# Altium project compute_fpga.PrjPcb (part 2 of 2)

## Sheet compute module USB.SchDoc: Compute Module USB
size A4; Organization: Blinkinlabs, LLC; DocumentNumber: 7; SheetNumber: 7; SheetTotal: 14
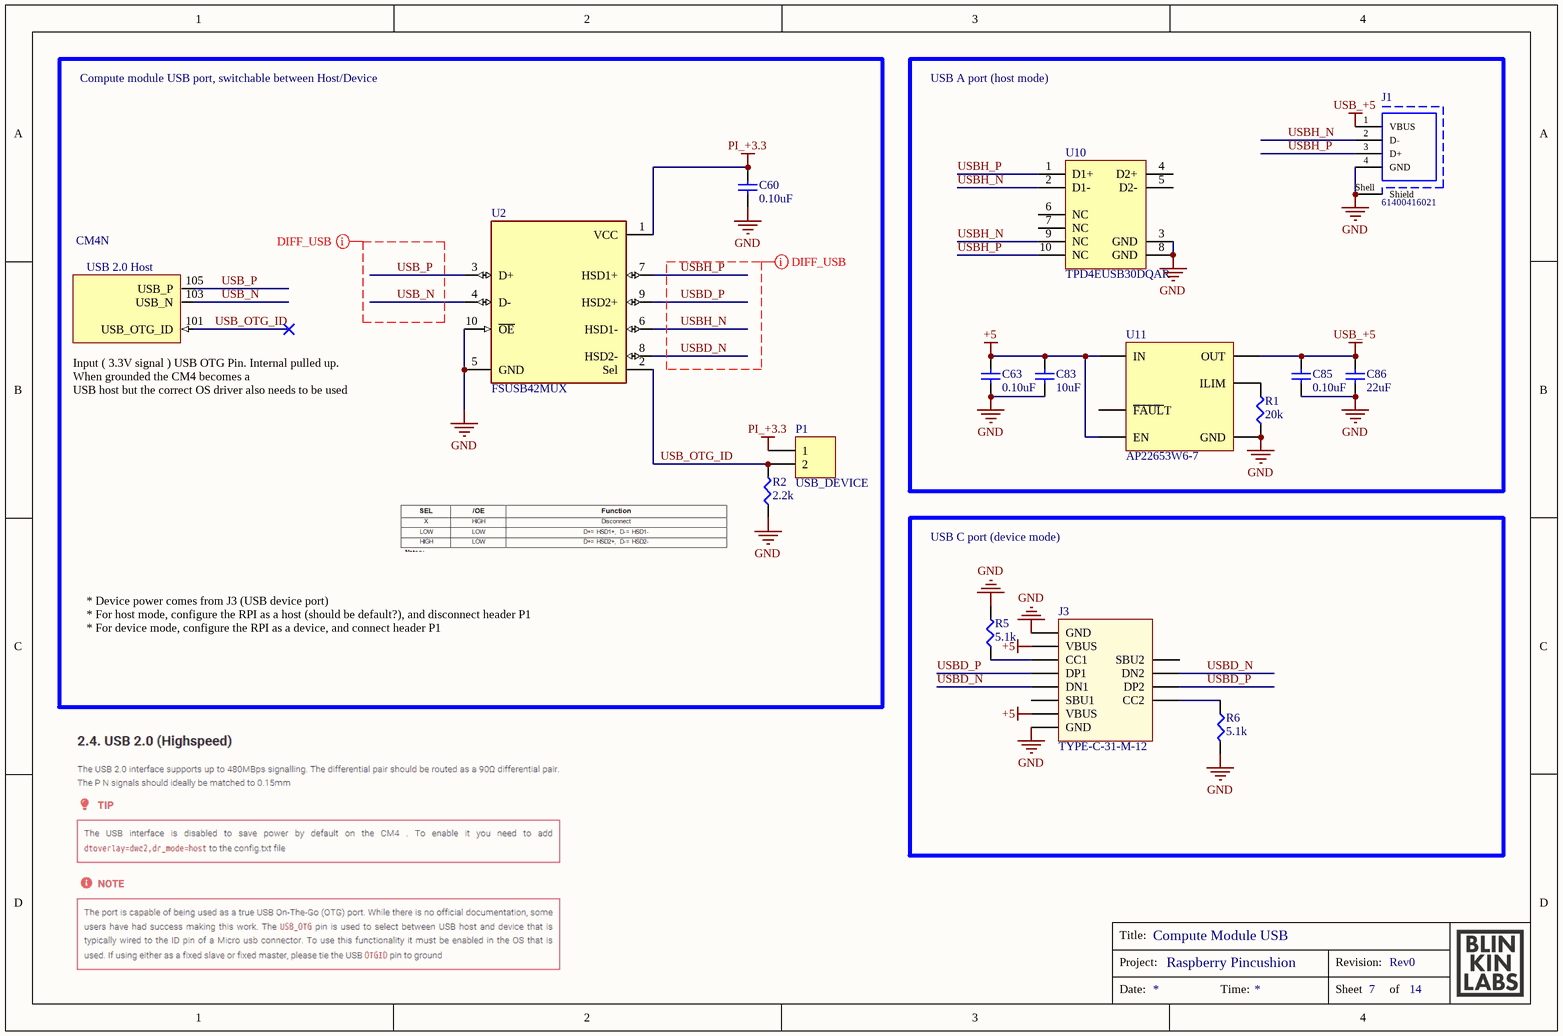
[diagram p10: compute module USB.SchDoc]

### Parts
C60  0.10uF  [CAPC1005X06L]
C63  0.10uF  [CAPC1005X06L]
C83  10uF  [CAPC2012X10L]
C85  0.10uF  [CAPC1005X06L]
C86  22uF  [CAPC2012X10L]
CM4  Raspberry Pi Compute Module 4  [CM4-F40C-100DS-0.4v_1.5mm_0mm]  (value not drawn)  (part N of 21)
J1  61400416021  [61400416021]
J3  TYPE-C-31-M-12  [TYPE-C-31-M-12]
P1  USB_DEVICE  [HDR1X2]
R1  20k  [ERJ2G(0402)_L]
R2  2.2k  [ERJ2G(0402)_L]
R5  5.1k  [ERJ2G(0402)_N]
R6  5.1k  [ERJ2G(0402)_N]
U2  FSUSB42MUX  [FP-846AP-MFG]
U10  TPD4EUSB30DQAR  [DQA0010A_V]
U11  AP22653W6-7  [SOT95P280X145-6N-5]

### Blocks framed on the sheet
Compute module USB port, switchable between Host/Device: C60 CM4 P1 R2 U2
USB A port (host mode): C63 C83 C85 C86 J1 R1 U10 U11
USB C port (device mode): J3 R5 R6

### Nets
+5: C63.2 C83.1 J3.A4/B9(VBUS) J3.A9/B4(VBUS) U11.1(IN) U11.3(EN)
GND: C60.1 C63.1 C83.2 C85.1 C86.2 J1.4(GND) J1.Shell(Shield) J3.A1/B12(GND) J3.A12/B1(GND) R1.1 R2.1 R5.2 R6.2 U2.5(GND) U2.10(~{OE}) U10.3(GND) U10.8(GND) U11.2(GND)
PI_+3.3: C60.2 P1.1 U2.1(VCC)
USB_+5: C85.2 C86.1 J1.1(VBUS) U11.6(OUT)
USB_N: CM4.103(USB_N) U2.4(D-)
USB_OTG_ID: CM4.101(USB_OTG_ID) P1.2 R2.2 U2.2(Sel)
USB_P: CM4.105(USB_P) U2.3(D+)
USBD_N: J3.A7(DN1) J3.B7(DN2) U2.8(HSD2-)
USBD_P: J3.A6(DP1) J3.B6(DP2) U2.9(HSD2+)
USBH_N: J1.2(D-) U2.6(HSD1-) U10.2(D1-) U10.9(NC)
USBH_P: J1.3(D+) U2.7(HSD1+) U10.1(D1+) U10.10(NC)
NetJ3_A5: J3.A5(CC1) R5.1
NetJ3_B5: J3.B5(CC2) R6.1
NetR1_2: R1.2 U11.5(ILIM)

Not connected (* = marked no-connect by the designer): J3 A8(SBU1) B8(SBU2); U10 4(D2+) 5(D2-) 6(NC) 7(NC); U11 4(~{FAUL}T)

### Layout directives
differential pair; differential pair class DIFF_90Ohm_USB; differential pair class DIFF_USB_HS; net class USB_480MBps; rule Matched Net Lengths [Tolerance = 0.15mm]: USB_N, USB_P, USBD_N, USBD_P, USBH_N, USBH_P

### Notes on the sheet
- * Device power comes from J3 (USB device port)
  * For host mode, configure the RPI as a host (should be default?), and disconnect header P1
  * For device mode, configure the RPI as a device, and connect header P1
- Title:
- Project:
- Revision:
- Date:
- Time:
- Sheet
- of
- (in symbol CM4, part N) USB 2.0 Host; Input ( 3.3V signal ) USB OTG Pin. Internal pulled up. When grounded the CM4 becomes a / USB host but the correct OS driver also needs to be used

### Library data of the parts
C60 C63 C85 = GRM155R61A104KA01D: CAP CER 0.1UF 10V X5R 0402; Manufacturer: Murata Electronics North America; Tolerance: ±10%; PartNumber: GRM155R61A104KA01D; Datasheets: http://www.murata.com/~/media/webrenewal/support/library/catalog/products/capacitor/mlcc/c02e.pdf; Image: //media.digikey.com/Renders/Murata%20Renders/ZRB-SERIES-0402.jpg; Digi-Key Part Number: 490-1318-1-ND; Packaging: Cut Tape (CT); Series: GRM; Value: 0.10uF; Voltage: 10V; Temperature Coefficient: X5R; Operating Temperature: -55°C ~ 85°C; Features: -; Applications: General Purpose; Package / Case: 0402 (1005 Metric); Case/Package: 0402
C83 = GRM21BR71A106KE51L: CAP CER 10UF 10V X7R 0805; Manufacturer: Murata Electronics North America; Tolerance: ±10%; PartNumber: GRM21BR71A106KE51L; Datasheets: http://www.murata.com/~/media/webrenewal/support/library/catalog/products/capacitor/mlcc/c02e.pdf; Image: //media.digikey.com/Renders/Murata%20Renders/0805%20(2012%20Metric)%20.85mm.jpg; Digi-Key Part Number: 490-3905-1-ND; Series: GRM; Part Status: Active; Value: 10uF; Voltage: 10V; Temperature Coefficient: X7R; Operating Temperature: -55°C ~ 125°C; Features: -; Applications: General Purpose; Mounting Type: Surface Mount, MLCC; Package / Case: 0805 (2012 Metric); Case/Package: 0805
C86 = GRM219R61A226MEA0D: CAP CER 22UF 10V X5R 0805; Manufacturer: Murata Electronics North America; Tolerance: ±20%; PartNumber: GRM219R61A226MEA0D; Datasheets: http://www.murata.com/~/media/webrenewal/support/library/catalog/products/capacitor/mlcc/c02e.pdf; Image: //media.digikey.com/Renders/Murata%20Renders/0805%20(2012%20Metric)%20.85mm.jpg; Digi-Key Part Number: 490-9951-1-ND; Series: GRM; Part Status: Active; Value: 22uF; Voltage: 10V; Temperature Coefficient: X5R; Operating Temperature: -55°C ~ 85°C; Features: Derating Recommended; Applications: General Purpose; Mounting Type: Surface Mount, MLCC; Package / Case: 0805 (2012 Metric); Case/Package: 0805
CM4 = CM4: Raspberry Pi Compute Module 4 by Amornthep Phunsin
J1 = CMP-1502-03227-1: USB 2.0 Type A Receptacle WR-COM, Horizontal, THT; Manufacturer: Wurth Elektronik; Working Voltage: 30VAC; Rated Current: 1.5A; Contact Resistance: 20mOhm; Manufacturer URL: http://www.we-online.de; Publisher: WurthElektronik; Packaging: Tray; Operating Temperature: -40to105degC; Orientation: Horizontal; Mounting Technology: THT; Part Number: 61400416021; Gender: Receptacle; Package Reference: 61400416021; Connector Type: USB2.0TypeA; Datasheet URL: https://katalog.we-online.de/em/datasheet/61400416021.pdf
J3 = TYPE-C-31-M-12: USB Connector TYPE-C-31-M-12 Female 16P SMD; Manufacturer: HRO; PartNumber: TYPE-C-31-M-12
P1 = Header 2: Header, 2-Pin; LatestRevisionDate: 17-Jul-2002; LatestRevisionNote: Re-released for DXP Platform.; Publisher: Altium Limited
R1 = ERJ-2RKF2002X: RES SMD 20K OHM 1% 1/10W 0402; Manufacturer: Panasonic Electronic Components; Power (Watts): 0.1W, 1/10W; Temperature Coefficient: ±100ppm/°C; PartNumber: ERJ-2RKF2002X; Datasheets: http://industrial.panasonic.com/www-cgi/jvcr13pz.cgi?E+PZ+3+AOA0002+ERJ2RKF2002X+7+WW; Image: //media.digikey.com/Photos/Panasonic%20Photos/ERJ-PA2-Series.jpg; Digi-Key Part Number: P20.0KLCT-ND; Series: ERJ; Value: 20k; Tolerance: ±1%; Composition: Thick Film; Features: Automotive AEC-Q200; Operating Temperature: -55°C ~ 155°C; Package / Case: 0402 (1005 Metric); Case/Package: 0402; Size / Dimension: 0.039" L x 0.020" W (1.00mm x 0.50mm); Height - Seated (Max): 0.016" (0.40mm); Number of Terminations: 2
R2 = ERJ-2RKF2201X: RES SMD 2.2K OHM 1% 1/10W 0402; Manufacturer: Panasonic Electronic Components; Power (Watts): 0.1W, 1/10W; Temperature Coefficient: ±100ppm/°C; PartNumber: ERJ-2RKF2201X; Datasheets: http://industrial.panasonic.com/www-cgi/jvcr13pz.cgi?E+PZ+3+AOA0002+ERJ2RKF2201X+7+WW; Image: //media.digikey.com/Photos/Panasonic%20Photos/ERJ-PA2-Series.jpg; Digi-Key Part Number: P2.20KLCT-ND; Series: ERJ; Value: 2.2k; Tolerance: ±1%; Composition: Thick Film; Features: Automotive AEC-Q200; Operating Temperature: -55°C ~ 155°C; Package / Case: 0402 (1005 Metric); Case/Package: 0402; Size / Dimension: 0.039" L x 0.020" W (1.00mm x 0.50mm); Height - Seated (Max): 0.016" (0.40mm); Number of Terminations: 2
R5 R6 = ERJ-2RKF5101X: RES SMD 5.1K OHM 1% 1/10W 0402; Manufacturer: Panasonic Electronic Components; Power (Watts): 0.1W, 1/10W; Temperature Coefficient: ±100ppm/°C; PartNumber: ERJ-2RKF5101X; Datasheets: http://industrial.panasonic.com/www-cgi/jvcr13pz.cgi?E+PZ+3+AOA0002+ERJ2RKF5101X+7+WW; Image: //media.digikey.com/Photos/Panasonic%20Photos/ERJ-PA2-Series.jpg; Digi-Key Part Number: P5.10KLCT-ND; Series: ERJ; Value: 5.1k; Tolerance: ±1%; Composition: Thick Film; Features: Automotive AEC-Q200; Operating Temperature: -55°C ~ 155°C; Package / Case: 0402 (1005 Metric); Case/Package: 0402; Size / Dimension: 0.039" L x 0.020" W (1.00mm x 0.50mm); Height - Seated (Max): 0.016" (0.40mm); Number of Terminations: 2
U2 = CMP-07103-000004-1: IC USB SWITCH DPDT 10MSOP; Voltage: 4.3V; Current: 100mA; Number of Inputs: 2; Supply Type: Single; Number of Outputs: 4; Data Rate: 480Mbps; On-State Resistance: 6.5R; Min Supply Voltage: 3V; Package Quantity: 1; Length: 3mm; Radiation Hardening: No; Number of Pins: 10; Width: 3mm; Number of Channels: 2; REACH SVHC: No SVHC; Lead Free: Lead Free; Max Operating Temperature: 85°C; Min Operating Temperature: -40°C; Packaging: Tape and Reel; Throw Configuration: DPDT; Operating Supply Voltage: 4.3V; Max Supply Voltage: 4.3V; Mount: Surface Mount; Case/Package: MSOP; Weight: 0.1125g; Height: 0.85mm
U10 = CMP-0326-00027-3: ESD Solution for Super-Speed (6 GBPS) USB 3.0 Interface, 4 Channels, -40 to +85 degC, 10-pin SON (DQA), Green (RoHS & no Sb/Br); Manufacturer: Texas Instruments; Differential Capacitance(pF): 0.05; Serial ATA / eSATA: TRUE; IO Capacitance(Typ)(pF): 0.8; IO Leakage Current(nA): 10; IEC 61000-4-2 Air-Gap(+/- kV): 8; ComponentLink3Description: URL Link1; PartNumber: TPD4EUSB30DQAR; DatasheetVersion: SLVSAC2C; ComponentLink2URL: http://www.ti.com/general/docs/lit/getliterature.tsp?genericPartNumber=TPD4EUSB30&fileType=pdf; USB Super Speed: TRUE; Eco-Plan: Green (RoHS & no Sb/Br); Mounting Technology: Surface Mount; 1394 / Firewire: TRUE; PackageVersion: revB, Sep-2009; SubFamily: ESD Solution; USB Full Speed: TRUE; USB High Speed: TRUE; ComponentLink2Description: Datasheet; ComponentLink1URL: http://www.ti.com/; IEC 61000-4-2 Contact(+/- kV): 8; Breakdown Voltage(Min)(V): 8; PackageReference: DQA0010A; ComponentLink1Description: Manufacturer URL; PackageDescription: 10-Pin Plastic Small Outline No-Lead, 1 x 2.5 x 0.55 mm Body, 0.5 mm Pitch; ComponentLink3URL: SamplesURL:http://www.ti.com/product/tpd4eusb30#samples; HDMI: TRUE
U11 = AP22653W6-7: LOAD SWITCH,SOT26,T&R,3K; Manufacturer: Diodes Incorporated; PartNumber: AP22653W6-7; Digikey PartNumber: 31-AP22653W6-7TR-ND

## Sheet FPGA GPIO.SchDoc: FPGA GPIO
size A3; Organization: Blinkinlabs, LLC; DocumentNumber: 14; SheetNumber: 10; SheetTotal: 14
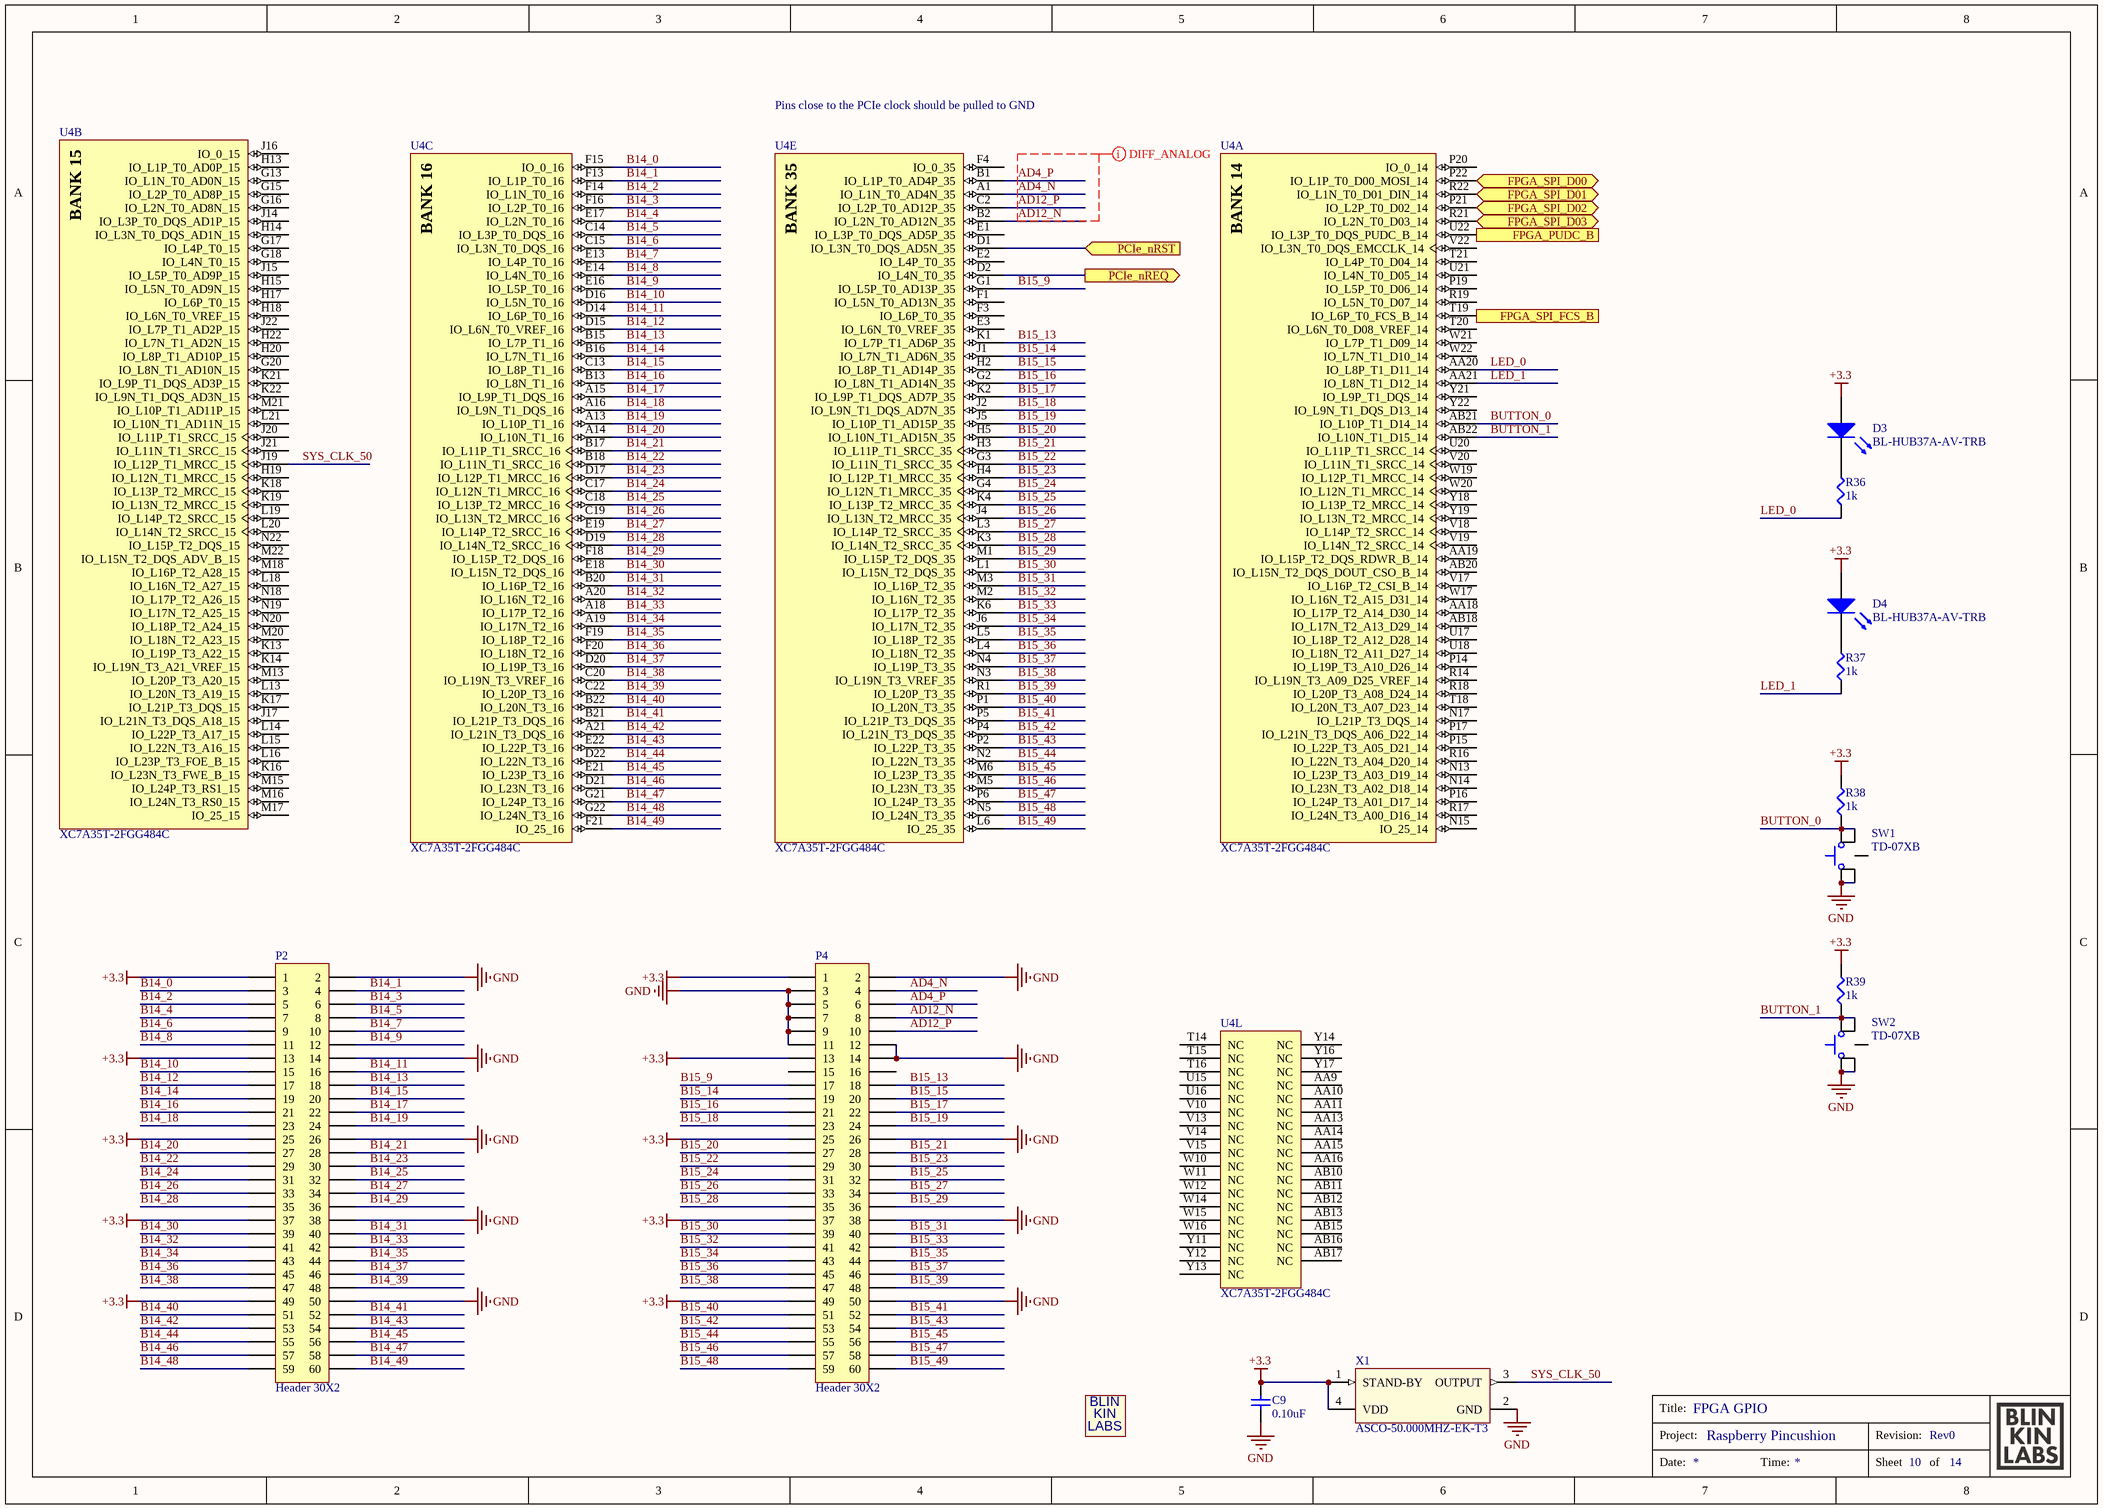
[diagram p11: FPGA GPIO.SchDoc]

### Parts
C9  0.10uF  [CAPC1005X06L]
D3  BL-HUB37A-AV-TRB  [BL-Hxx37A-AV-TRB]
D4  BL-HUB37A-AV-TRB  [BL-Hxx37A-AV-TRB]
L1  BLINKINLABS_LOGO  [BLINKINLABS_LOGO]  (value not drawn)  (no BOM)
P2  Header 30X2  [HDR2X30]
P4  Header 30X2  [HDR2X30]
R36  1k  [ERJ2G(0402)_L]
R37  1k  [ERJ2G(0402)_L]
R38  1k  [ERJ2G(0402)_L]
R39  1k  [ERJ2G(0402)_L]
SW1  TD-07XB  [TD-07XB]
SW2  TD-07XB  [TD-07XB]
U4  XC7A35T-2FGG484C  [FGG484]  (parts A,B,C,E,L of 12)
X1  ASCO-50.000MHZ-EK-T3  [ABRA-ASCO-50.000MHZ-EK-T3-4_V]

### Ports
FPGA_PUDC_B (in), FPGA_SPI_D00 (bidir), FPGA_SPI_D01 (bidir), FPGA_SPI_D02 (bidir), FPGA_SPI_D03 (bidir), FPGA_SPI_FCS_B (out), PCIe_nREQ (out), PCIe_nRST (in)

### Nets
+3.3: C9.2 D3.1 D4.1 P2.1 P2.13 P2.25 P2.37 P2.49 P4.1 P4.13 P4.25 P4.37 P4.49 R38.2 R39.2 X1.1(STAND-BY) X1.4(VDD)
GND: C9.1 P2.2 P2.14 P2.26 P2.38 P2.50 P4.2 P4.3 P4.5 P4.7 P4.9 P4.11 P4.12 P4.14 P4.26 P4.38 P4.50 SW1.1 SW1.2 SW2.1 SW2.2 X1.2(GND)
AD4_N: P4.4 U4.A1(IO_L1N_T0_AD4N_35)
AD4_P: P4.6 U4.B1(IO_L1P_T0_AD4P_35)
AD12_N: P4.8 U4.B2(IO_L2N_T0_AD12N_35)
AD12_P: P4.10 U4.C2(IO_L2P_T0_AD12P_35)
B14_0: P2.3 U4.F15(IO_0_16)
B14_1: P2.4 U4.F13(IO_L1P_T0_16)
B14_2: P2.5 U4.F14(IO_L1N_T0_16)
B14_3: P2.6 U4.F16(IO_L2P_T0_16)
B14_4: P2.7 U4.E17(IO_L2N_T0_16)
B14_5: P2.8 U4.C14(IO_L3P_T0_DQS_16)
B14_6: P2.9 U4.C15(IO_L3N_T0_DQS_16)
B14_7: P2.10 U4.E13(IO_L4P_T0_16)
B14_8: P2.11 U4.E14(IO_L4N_T0_16)
B14_9: P2.12 U4.E16(IO_L5P_T0_16)
B14_10: P2.15 U4.D16(IO_L5N_T0_16)
B14_11: P2.16 U4.D14(IO_L6P_T0_16)
B14_12: P2.17 U4.D15(IO_L6N_T0_VREF_16)
B14_13: P2.18 U4.B15(IO_L7P_T1_16)
B14_14: P2.19 U4.B16(IO_L7N_T1_16)
B14_15: P2.20 U4.C13(IO_L8P_T1_16)
B14_16: P2.21 U4.B13(IO_L8N_T1_16)
B14_17: P2.22 U4.A15(IO_L9P_T1_DQS_16)
B14_18: P2.23 U4.A16(IO_L9N_T1_DQS_16)
B14_19: P2.24 U4.A13(IO_L10P_T1_16)
B14_20: P2.27 U4.A14(IO_L10N_T1_16)
B14_21: P2.28 U4.B17(IO_L11P_T1_SRCC_16)
B14_22: P2.29 U4.B18(IO_L11N_T1_SRCC_16)
B14_23: P2.30 U4.D17(IO_L12P_T1_MRCC_16)
B14_24: P2.31 U4.C17(IO_L12N_T1_MRCC_16)
B14_25: P2.32 U4.C18(IO_L13P_T2_MRCC_16)
B14_26: P2.33 U4.C19(IO_L13N_T2_MRCC_16)
B14_27: P2.34 U4.E19(IO_L14P_T2_SRCC_16)
B14_28: P2.35 U4.D19(IO_L14N_T2_SRCC_16)
B14_29: P2.36 U4.F18(IO_L15P_T2_DQS_16)
B14_30: P2.39 U4.E18(IO_L15N_T2_DQS_16)
B14_31: P2.40 U4.B20(IO_L16P_T2_16)
B14_32: P2.41 U4.A20(IO_L16N_T2_16)
B14_33: P2.42 U4.A18(IO_L17P_T2_16)
B14_34: P2.43 U4.A19(IO_L17N_T2_16)
B14_35: P2.44 U4.F19(IO_L18P_T2_16)
B14_36: P2.45 U4.F20(IO_L18N_T2_16)
B14_37: P2.46 U4.D20(IO_L19P_T3_16)
B14_38: P2.47 U4.C20(IO_L19N_T3_VREF_16)
B14_39: P2.48 U4.C22(IO_L20P_T3_16)
B14_40: P2.51 U4.B22(IO_L20N_T3_16)
B14_41: P2.52 U4.B21(IO_L21P_T3_DQS_16)
B14_42: P2.53 U4.A21(IO_L21N_T3_DQS_16)
B14_43: P2.54 U4.E22(IO_L22P_T3_16)
B14_44: P2.55 U4.D22(IO_L22N_T3_16)
B14_45: P2.56 U4.E21(IO_L23P_T3_16)
B14_46: P2.57 U4.D21(IO_L23N_T3_16)
B14_47: P2.58 U4.G21(IO_L24P_T3_16)
B14_48: P2.59 U4.G22(IO_L24N_T3_16)
B14_49: P2.60 U4.F21(IO_25_16)
B15_9: P4.17 U4.G1(IO_L5P_T0_AD13P_35)
B15_13: P4.18 U4.K1(IO_L7P_T1_AD6P_35)
B15_14: P4.19 U4.J1(IO_L7N_T1_AD6N_35)
B15_15: P4.20 U4.H2(IO_L8P_T1_AD14P_35)
B15_16: P4.21 U4.G2(IO_L8N_T1_AD14N_35)
B15_17: P4.22 U4.K2(IO_L9P_T1_DQS_AD7P_35)
B15_18: P4.23 U4.J2(IO_L9N_T1_DQS_AD7N_35)
B15_19: P4.24 U4.J5(IO_L10P_T1_AD15P_35)
B15_20: P4.27 U4.H5(IO_L10N_T1_AD15N_35)
B15_21: P4.28 U4.H3(IO_L11P_T1_SRCC_35)
B15_22: P4.29 U4.G3(IO_L11N_T1_SRCC_35)
B15_23: P4.30 U4.H4(IO_L12P_T1_MRCC_35)
B15_24: P4.31 U4.G4(IO_L12N_T1_MRCC_35)
B15_25: P4.32 U4.K4(IO_L13P_T2_MRCC_35)
B15_26: P4.33 U4.J4(IO_L13N_T2_MRCC_35)
B15_27: P4.34 U4.L3(IO_L14P_T2_SRCC_35)
B15_28: P4.35 U4.K3(IO_L14N_T2_SRCC_35)
B15_29: P4.36 U4.M1(IO_L15P_T2_DQS_35)
B15_30: P4.39 U4.L1(IO_L15N_T2_DQS_35)
B15_31: P4.40 U4.M3(IO_L16P_T2_35)
B15_32: P4.41 U4.M2(IO_L16N_T2_35)
B15_33: P4.42 U4.K6(IO_L17P_T2_35)
B15_34: P4.43 U4.J6(IO_L17N_T2_35)
B15_35: P4.44 U4.L5(IO_L18P_T2_35)
B15_36: P4.45 U4.L4(IO_L18N_T2_35)
B15_37: P4.46 U4.N4(IO_L19P_T3_35)
B15_38: P4.47 U4.N3(IO_L19N_T3_VREF_35)
B15_39: P4.48 U4.R1(IO_L20P_T3_35)
B15_40: P4.51 U4.P1(IO_L20N_T3_35)
B15_41: P4.52 U4.P5(IO_L21P_T3_DQS_35)
B15_42: P4.53 U4.P4(IO_L21N_T3_DQS_35)
B15_43: P4.54 U4.P2(IO_L22P_T3_35)
B15_44: P4.55 U4.N2(IO_L22N_T3_35)
B15_45: P4.56 U4.M6(IO_L23P_T3_35)
B15_46: P4.57 U4.M5(IO_L23N_T3_35)
B15_47: P4.58 U4.P6(IO_L24P_T3_35)
B15_48: P4.59 U4.N5(IO_L24N_T3_35)
B15_49: P4.60 U4.L6(IO_25_35)
BUTTON_0: R38.1 SW1.3 SW1.4 U4.AB21(IO_L10P_T1_D14_14)
BUTTON_1: R39.1 SW2.3 SW2.4 U4.AB22(IO_L10N_T1_D15_14)
FPGA_PUDC_B: U4.U22(IO_L3P_T0_DQS_PUDC_B_14) ; port FPGA_PUDC_B
FPGA_SPI_D02: U4.P21(IO_L2P_T0_D02_14) ; port FPGA_SPI_D02
FPGA_SPI_D03: U4.R21(IO_L2N_T0_D03_14) ; port FPGA_SPI_D03
FPGA_SPI_DO0: U4.P22(IO_L1P_T0_D00_MOSI_14) ; port FPGA_SPI_D00
FPGA_SPI_DO1: U4.R22(IO_L1N_T0_D01_DIN_14) ; port FPGA_SPI_D01
FPGA_SPI_FCS_B: U4.T19(IO_L6P_T0_FCS_B_14) ; port FPGA_SPI_FCS_B
LED_0: R36.1 U4.AA20(IO_L8P_T1_D11_14)
LED_1: R37.1 U4.AA21(IO_L8N_T1_D12_14)
PCIe_nREQ: U4.D2(IO_L4N_T0_35) ; port PCIe_nREQ
PCIe_nRST: U4.D1(IO_L3N_T0_DQS_AD5N_35) ; port PCIe_nRST
SYS_CLK_50: U4.J19(IO_L12P_T1_MRCC_15) X1.3(OUTPUT)
NetD3_2: D3.2 R36.2
NetD4_2: D4.2 R37.2

Not connected (* = marked no-connect by the designer): P4 15 16; SW1 5; SW2 5; U4 AA9(NC) AA10(NC) AA11(NC) AA13(NC) AA14(NC) AA15(NC) AA16(NC) AA18(IO_L17P_T2_A14_D30_14) AA19(IO_L15P_T2_DQS_RDWR_B_14) AB10(NC) AB11(NC) AB12(NC) AB13(NC) AB15(NC) AB16(NC) AB17(NC) AB18(IO_L17N_T2_A13_D29_14) AB20(IO_L15N_T2_DQS_DOUT_CSO_B_14) E1(IO_L3P_T0_DQS_AD5P_35) E2(IO_L4P_T0_35) E3(IO_L6N_T0_VREF_35) F1(IO_L5N_T0_AD13N_35) F3(IO_L6P_T0_35) F4(IO_0_35) G13(IO_L1N_T0_AD0N_15) G15(IO_L2P_T0_AD8P_15) G16(IO_L2N_T0_AD8N_15) G17(IO_L4P_T0_15) G18(IO_L4N_T0_15) G20(IO_L8N_T1_AD10N_15) H13(IO_L1P_T0_AD0P_15) H14(IO_L3N_T0_DQS_AD1N_15) H15(IO_L5N_T0_AD9N_15) H17(IO_L6P_T0_15) H18(IO_L6N_T0_VREF_15) H19(IO_L12N_T1_MRCC_15) H20(IO_L8P_T1_AD10P_15) H22(IO_L7N_T1_AD2N_15) J14(IO_L3P_T0_DQS_AD1P_15) J15(IO_L5P_T0_AD9P_15) J16(IO_0_15) J17(IO_L21N_T3_DQS_A18_15) J20(IO_L11P_T1_SRCC_15) J21(IO_L11N_T1_SRCC_15) J22(IO_L7P_T1_AD2P_15) K13(IO_L19P_T3_A22_15) K14(IO_L19N_T3_A21_VREF_15) K16(IO_L23N_T3_FWE_B_15) K17(IO_L21P_T3_DQS_15) K18(IO_L13P_T2_MRCC_15) K19(IO_L13N_T2_MRCC_15) K21(IO_L9P_T1_DQS_AD3P_15) K22(IO_L9N_T1_DQS_AD3N_15) L13(IO_L20N_T3_A19_15) L14(IO_L22P_T3_A17_15) L15(IO_L22N_T3_A16_15) L16(IO_L23P_T3_FOE_B_15) L18(IO_L16N_T2_A27_15) L19(IO_L14P_T2_SRCC_15) L20(IO_L14N_T2_SRCC_15) L21(IO_L10N_T1_AD11N_15) M13(IO_L20P_T3_A20_15) M15(IO_L24P_T3_RS1_15) M16(IO_L24N_T3_RS0_15) M17(IO_25_15) M18(IO_L16P_T2_A28_15) M20(IO_L18N_T2_A23_15) M21(IO_L10P_T1_AD11P_15) M22(IO_L15N_T2_DQS_ADV_B_15) N13(IO_L23P_T3_A03_D19_14) N14(IO_L23N_T3_A02_D18_14) N15(IO_25_14) N17(IO_L21P_T3_DQS_14) N18(IO_L17P_T2_A26_15) N19(IO_L17N_T2_A25_15) N20(IO_L18P_T2_A24_15) N22(IO_L15P_T2_DQS_15) P14(IO_L19P_T3_A10_D26_14) P15(IO_L22P_T3_A05_D21_14) P16(IO_L24P_T3_A01_D17_14) P17(IO_L21N_T3_DQS_A06_D22_14) P19(IO_L5P_T0_D06_14) P20(IO_0_14) R14(IO_L19N_T3_A09_D25_VREF_14) R16(IO_L22N_T3_A04_D20_14) R17(IO_L24N_T3_A00_D16_14) R18(IO_L20P_T3_A08_D24_14) R19(IO_L5N_T0_D07_14) T14(NC) T15(NC) T16(NC) T18(IO_L20N_T3_A07_D23_14) T20(IO_L6N_T0_D08_VREF_14) T21(IO_L4P_T0_D04_14) U15(NC) U16(NC) U17(IO_L18P_T2_A12_D28_14) U18(IO_L18N_T2_A11_D27_14) U20(IO_L11P_T1_SRCC_14) U21(IO_L4N_T0_D05_14) V10(NC) V13(NC) V14(NC) V15(NC) V17(IO_L16P_T2_CSI_B_14) V18(IO_L14P_T2_SRCC_14) V19(IO_L14N_T2_SRCC_14) V20(IO_L11N_T1_SRCC_14) V22(IO_L3N_T0_DQS_EMCCLK_14) W10(NC) W11(NC) W12(NC) W14(NC) W15(NC) W16(NC) W17(IO_L16N_T2_A15_D31_14) W19(IO_L12P_T1_MRCC_14) W20(IO_L12N_T1_MRCC_14) W21(IO_L7P_T1_D09_14) W22(IO_L7N_T1_D10_14) Y11(NC) Y12(NC) Y13(NC) Y14(NC) Y16(NC) Y17(NC) Y18(IO_L13P_T2_MRCC_14) Y19(IO_L13N_T2_MRCC_14) Y21(IO_L9P_T1_DQS_14) Y22(IO_L9N_T1_DQS_D13_14)

### Layout directives
differential pair; differential pair class DIFF_100Ohm_HDMI; differential pair class DIFF_ANALOG; net class ANALOG: AD4_N, AD4_P, AD12_N, AD12_P

### Notes on the sheet
- Pins close to the PCIe clock should be pulled to GND
- Title:
- Project:
- Revision:
- Date:
- Time:
- Sheet
- of
- (in symbol BLINKINLABS_LOGO) BLIN; KIN; LABS
- (in symbol CMP-0383-00019-1, part A) BANK 14
- (in symbol CMP-0383-00019-1, part B) BANK 15
- (in symbol CMP-0383-00019-1, part C) BANK 16
- (in symbol CMP-0383-00019-1, part E) BANK 35

### Library data of the parts
C9 = GRM155R61A104KA01D: as C60 on sheet compute module USB; PartNumber: GRM155R61A104KA01D; Datasheets: http://www.murata.com/~/media/webrenewal/support/library/catalog/products/capacitor/mlcc/c02e.pdf; Image: //media.digikey.com/Renders/Murata%20Renders/ZRB-SERIES-0402.jpg; Digi-Key Part Number: 490-1318-1-ND; Packaging: Cut Tape (CT); Series: GRM; Value: 0.10uF; Voltage: 10V; Temperature Coefficient: X5R; Operating Temperature: -55°C ~ 85°C; Features: -; Applications: General Purpose; Package / Case: 0402 (1005 Metric); Case/Package: 0402
D3 D4 = BL-HUB37A-AV-TRB: LED, 0402, Super Red, 50mcd@20mA, 627~637nm; Manufacturer: BrtLed(佰鸿); PartNumber: BL-HUB37A-AV-TRB; LCSC PartNumber: C165980
L1 = BLINKINLABS_LOGO: Square logo
P2 P4 = Header 30X2: Header, 30-Pin, Dual row; LatestRevisionDate: 17-Jul-2002; LatestRevisionNote: Re-released for DXP Platform.; Publisher: Altium Limited
R36-R39 = ERJ-2GEJ102X: RES SMD 1K OHM 5% 1/10W 0402; Manufacturer: Panasonic Electronic Components; Power (Watts): 0.1W, 1/10W; Temperature Coefficient: ±200ppm/°C; PartNumber: ERJ-2GEJ102X; Datasheets: http://industrial.panasonic.com/www-cgi/jvcr13pz.cgi?E+PZ+3+AOA0001+ERJ2GEJ102X+7+WW; Image: //media.digikey.com/Photos/Panasonic%20Photos/ERJ-PA2-Series.jpg; Digi-Key Part Number: P1.0KJCT-ND; Series: ERJ; Value: 1k; Tolerance: ±5%; Composition: Thick Film; Features: Automotive AEC-Q200; Operating Temperature: -55°C ~ 155°C; Package / Case: 0402 (1005 Metric); Case/Package: 0402; Size / Dimension: 0.039" L x 0.020" W (1.00mm x 0.50mm); Height - Seated (Max): 0.016" (0.40mm); Number of Terminations: 2
SW1 SW2 = TD-07XB: Tact Switch; Manufacturer: ShenZhen XieJia Electronics Co Ltd; PartNumber: TD-07XB
U4 = CMP-0383-00019-1: Artix-7 FPGA, 250 User I/Os, 4 GTP, 484-Ball BGA, Speed Grade 2, Commercial Grade, Pb-Free; Manufacturer: Xilinx; Total Block RAM: 1800 Kb; GTP: 4; Available User I/O: 250; Speed Grades: 2; Logic Cells: 33280; CMTs: 5; ComponentLink3URL: http://www.xilinx.com/support/documentation/user_guides/ug475_7Series_Pkg_Pinout.pdf; PackageVersion: Rev. 1.11; ComponentLink2Description: Datasheet; ComponentLink3Description: Pinout; PartNumber: XC7A35T-2FGG484C; DatasheetVersion: Rev. 1.15; Operating Temperature Range: Commercial; PackageDescription: 484-Ball Wire-Bond Fine-Pitch BGA, Body 23 x 23 mm, Pitch 1 mm; ComponentLink4Description: Package Specification; Maximum Distributed RAM: 400 Kb; Mounting Technology: Surface Mount; ComponentLink2URL: http://www.xilinx.com/support/documentation/data_sheets/ds180_7Series_Overview.pdf; ComponentLink1Description: Manufacturer URL; ComponentLink4URL: http://www.xilinx.com/support/documentation/user_guides/ug475_7Series_Pkg_Pinout.pdf; PackageReference: FGG484; ComponentLink1URL: http://www.xilinx.com/
X1 = CMP-0461-00001-3: Crystal Clock Oscillator, 50 MHz, -20 to 70 degC, 1.6 x 1.2 x 0.7 mm SMD; Manufacturer: Abracon; Frequency(MHz): 50; Aging: -3 to 3 3 ppm; Packing: Tape and Reel; Overall Frequency Stability: +/-30 ppm; Supply Current (Idd)
into 15pF Load: 6 mA; Supply Voltage (Vdd): 3.3 V; Output Load: 15 pF; ComponentLink2Description: Datasheet; ComponentLink3Description: Package Specification; ComponentLink3URL: http://www.abracon.com/Oscillators/ASCO.pdf; ComponentLink2URL: http://www.abracon.com/Oscillators/ASCO.pdf; Mounting Technology: Surface Mount; PackageDescription: 4-Pin Hand Drawn, Body 1.6 x 1.2 mm; DatasheetVersion: 01.25.13; ComponentLink1Description: Manufacturer URL; PartNumber: ASCO-50.000MHZ-EK-T3; Operating temperature: -20 to 70 degC; ComponentLink1URL: http://www.abracon.com; PackageReference: ASCO-50.000MHZ-EK-T3-4

## Sheet FPGA power supply.SchDoc: FPGA Power Supply
size A3; Organization: Blinkinlabs, LLC; DocumentNumber: 9; SheetNumber: 9; SheetTotal: 14
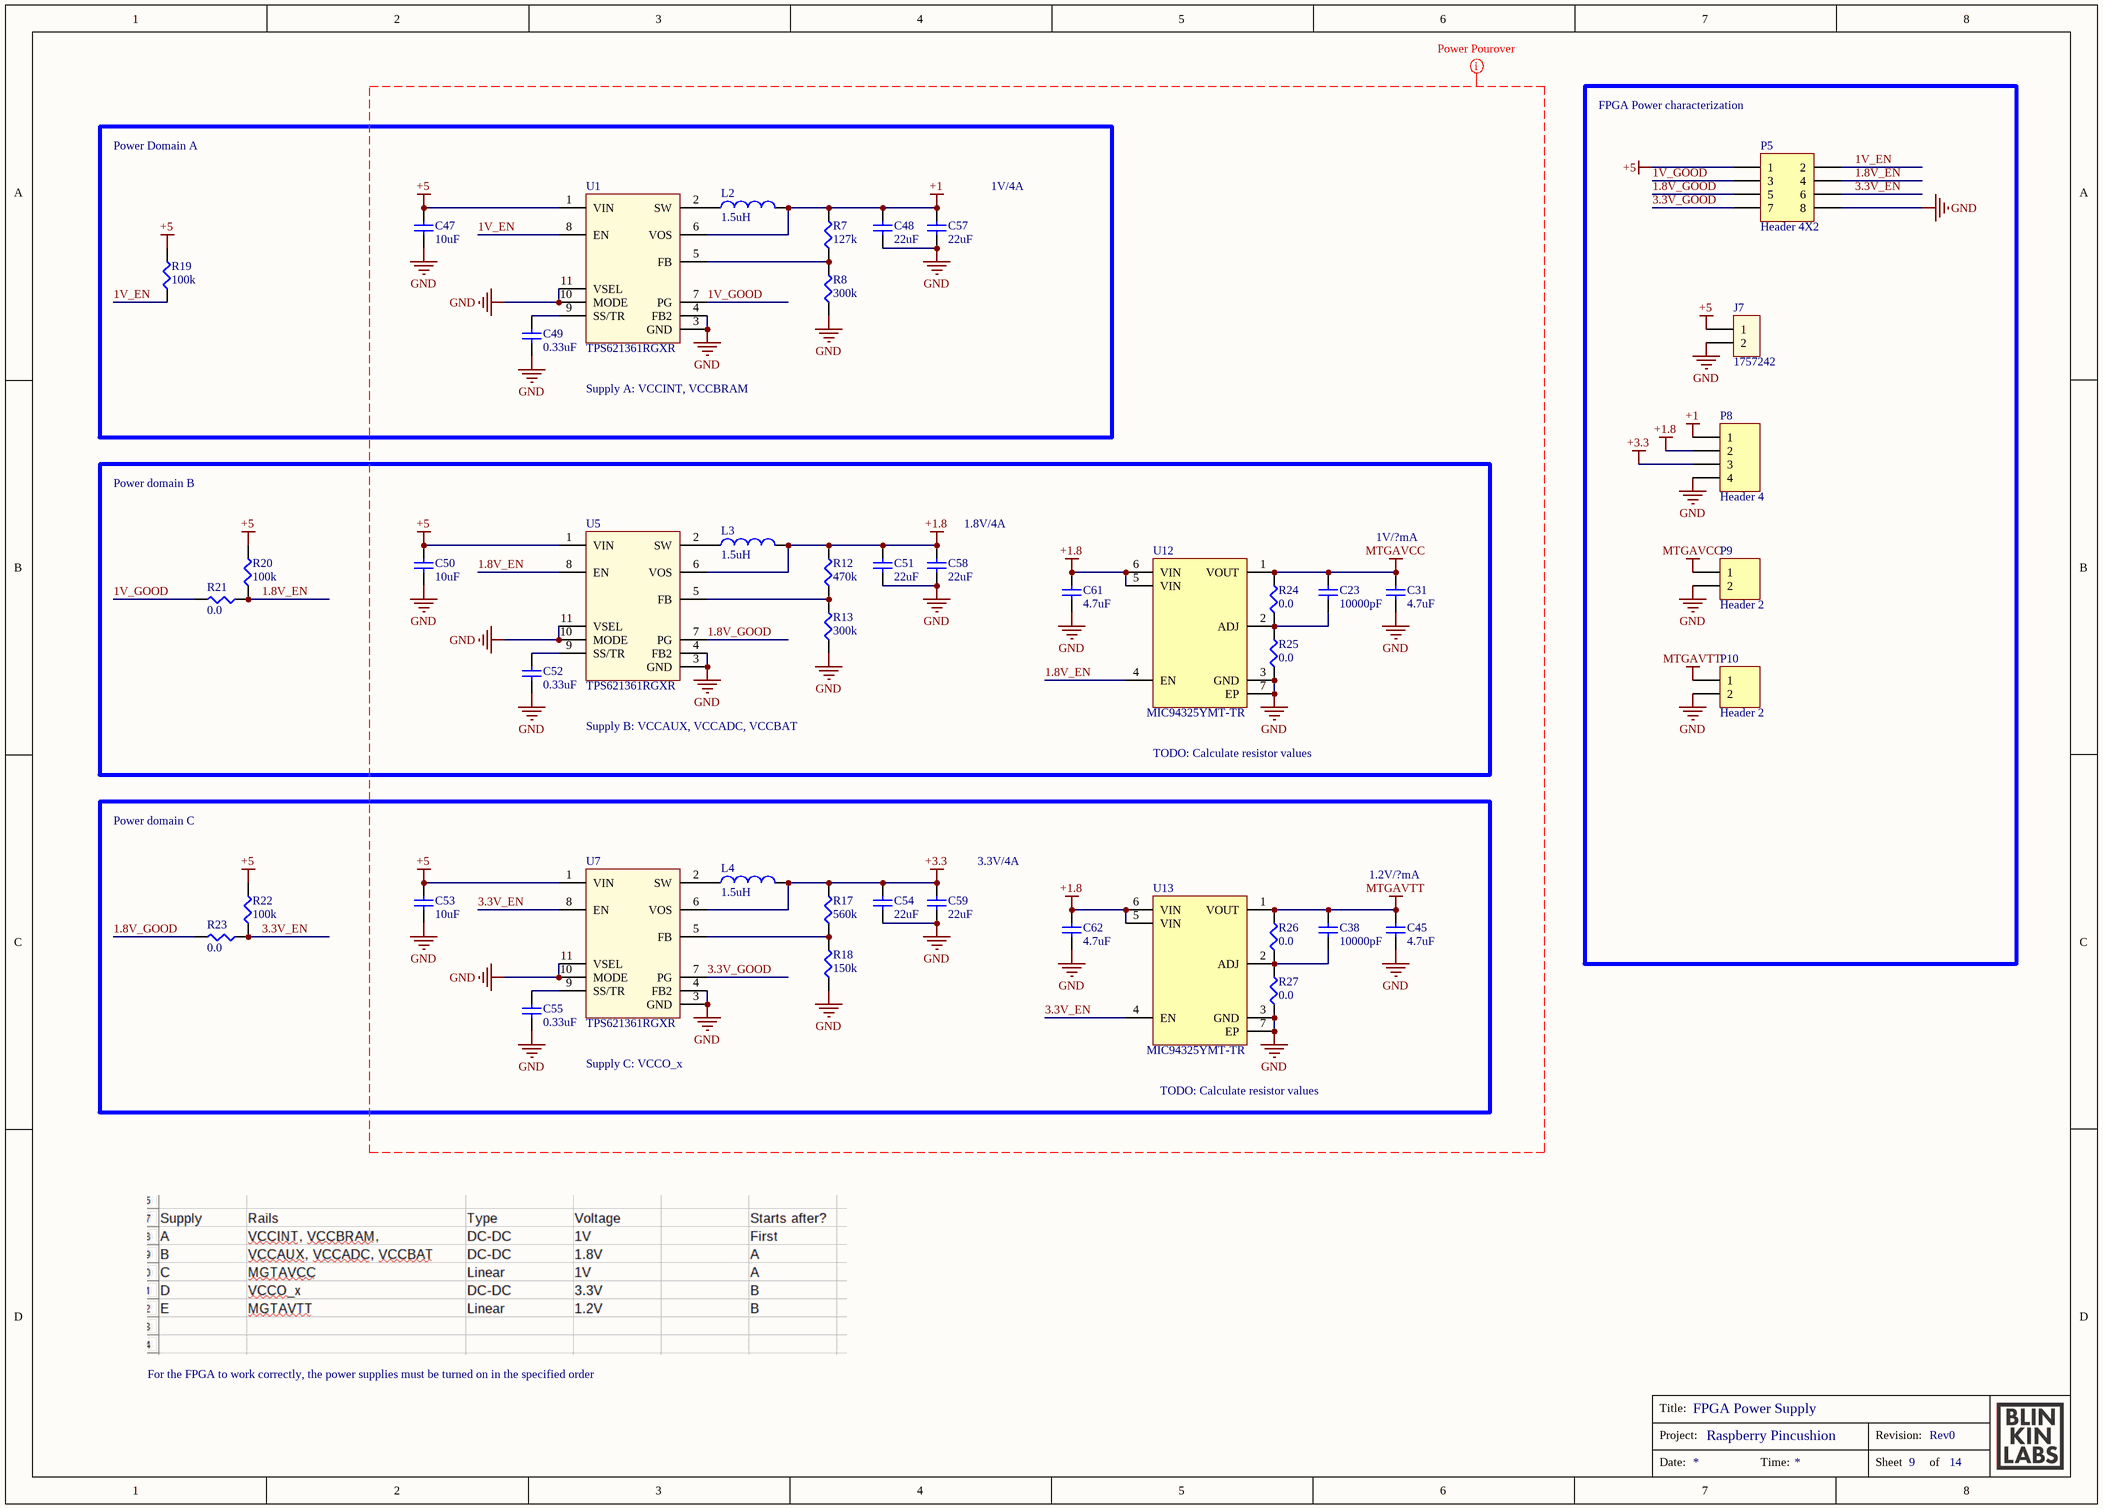
[diagram p12: FPGA power supply.SchDoc]

### Parts
C23  10000pF  [CAPC1005X06L]
C31  4.7uF  [CAPC1005X06L]
C38  10000pF  [CAPC1005X06L]
C45  4.7uF  [CAPC1005X06L]
C47  10uF  [CAPC2012X10L]
C48  22uF  [CAPC2012X10L]
C49  0.33uF  [CAPC1005X06L]
C50  10uF  [CAPC2012X10L]
C51  22uF  [CAPC2012X10L]
C52  0.33uF  [CAPC1005X06L]
C53  10uF  [CAPC2012X10L]
C54  22uF  [CAPC2012X10L]
C55  0.33uF  [CAPC1005X06L]
C57  22uF  [CAPC2012X10L]
C58  22uF  [CAPC2012X10L]
C59  22uF  [CAPC2012X10L]
C61  4.7uF  [CAPC1005X06L]
C62  4.7uF  [CAPC1005X06L]
J7  1757242  [1757242]
L2  1.5uH  [SWPA4030S]
L3  1.5uH  [SWPA4030S]
L4  1.5uH  [SWPA4030S]
P5  Header 4X2  [HDR2X4]
P8  Header 4  [HDR1X4]
P9  Header 2  [HDR1X2]
P10  Header 2  [HDR1X2]
R7  127k  [ERJ2G(0402)_L]
R8  300k  [ERJ2G(0402)_L]
R12  470k  [ERJ2G(0402)_L]
R13  300k  [ERJ2G(0402)_L]
R17  560k  [ERJ2G(0402)_L]
R18  150k  [ERJ2G(0402)_L]
R19  100k  [ERJ2G(0402)_L]
R20  100k  [ERJ2G(0402)_L]
R21  0.0  [ERJ2G(0402)_L]
R22  100k  [ERJ2G(0402)_L]
R23  0.0  [ERJ2G(0402)_L]
R24  0.0  [ERJ2G(0402)_L]
R25  0.0  [ERJ2G(0402)_L]
R26  0.0  [ERJ2G(0402)_L]
R27  0.0  [ERJ2G(0402)_L]
U1  TPS621361RGXR  [RGX0011A]
U5  TPS621361RGXR  [RGX0011A]
U7  TPS621361RGXR  [RGX0011A]
U12  MIC94325YMT-TR  [QFN50P160X160X60_HS-7N]
U13  MIC94325YMT-TR  [QFN50P160X160X60_HS-7N]

### Blocks framed on the sheet
FPGA Power characterization: J7 P5 P8-P10

### Nets
+1: C48.1 C57.1 L2.2 P8.1 R7.2 U1.6(VOS)
+1.8: C51.1 C58.1 C61.2 C62.2 L3.2 P8.2 R12.2 U5.6(VOS) U12.5(VIN) U12.6(VIN) U13.5(VIN) U13.6(VIN)
+3.3: C54.1 C59.1 L4.2 P8.3 R17.2 U7.6(VOS)
+5: C47.1 C50.1 C53.1 J7.1 P5.1 R19.2 R20.2 R22.2 U1.1(VIN) U5.1(VIN) U7.1(VIN)
GND: C31.1 C45.1 C47.2 C48.2 C49.2 C50.2 C51.2 C52.2 C53.2 C54.2 C55.2 C57.2 C58.2 C59.2 C61.1 C62.1 J7.2 P5.8 P8.4 P9.2 P10.2 R8.1 R13.1 R18.1 R25.1 R27.1 U1.3(GND) U1.4(FB2) U1.10(MODE) U1.11(VSEL) U5.3(GND) U5.4(FB2) U5.10(MODE) U5.11(VSEL) U7.3(GND) U7.4(FB2) U7.10(MODE) U7.11(VSEL) U12.3(GND) U12.7(EP) U13.3(GND) U13.7(EP)
MTGAVCC: C23.1 C31.2 P9.1 R24.2 U12.1(VOUT)
MTGAVTT: C38.1 C45.2 P10.1 R26.2 U13.1(VOUT)
1.8V_EN: P5.4 R20.1 R21.1 U5.8(EN) U12.4(EN)
1.8V_GOOD: P5.5 R23.2 U5.7(PG)
1V_EN: P5.2 R19.1 U1.8(EN)
1V_GOOD: P5.3 R21.2 U1.7(PG)
3.3V_EN: P5.6 R22.1 R23.1 U7.8(EN) U13.4(EN)
3.3V_GOOD: P5.7 U7.7(PG)
NetC23_2: C23.2 R24.1 R25.2 U12.2(ADJ)
NetC38_2: C38.2 R26.1 R27.2 U13.2(ADJ)
NetC49_1: C49.1 U1.9(SS/TR)
NetC52_1: C52.1 U5.9(SS/TR)
NetC55_1: C55.1 U7.9(SS/TR)
NetL2_1: L2.1 U1.2(SW)
NetL3_1: L3.1 U5.2(SW)
NetL4_1: L4.1 U7.2(SW)
NetR7_1: R7.1 R8.2 U1.5(FB)
NetR12_1: R12.1 R13.2 U5.5(FB)
NetR17_1: R17.1 R18.2 U7.5(FB)

### Layout directives
rule Polygon Connect Style [Style - Direct Connect]: 1.8V_EN, 1.8V_GOOD, 1V_EN, 1V_GOOD, 3.3V_EN, 3.3V_GOOD, +1, +1.8, +3.3, +5, GND, MTGAVCC, MTGAVTT

### Notes on the sheet
- Power Domain A
- 1V/4A
- Supply A: VCCINT, VCCBRAM
- Power domain B
- (near C58) 1.8V/4A
- 1V/?mA
- Supply B: VCCAUX, VCCADC, VCCBAT
- TODO: Calculate resistor values
- Power domain C
- 3.3V/4A
- 1.2V/?mA
- Supply C: VCCO_x
- For the FPGA to work correctly, the power supplies must be turned on in the specified order
- Title:
- Project:
- Revision:
- Date:
- Time:
- Sheet
- of

### Library data of the parts
C23 C38 = GRM155R71C103KA01D: CAP CER 10000PF 16V X7R 0402; Manufacturer: Murata Electronics North America; Tolerance: ±10%; PartNumber: GRM155R71C103KA01D; Datasheets: http://www.murata.com/~/media/webrenewal/support/library/catalog/products/capacitor/mlcc/c02e.pdf; Image: //media.digikey.com/Renders/Murata%20Renders/ZRB-SERIES-0402.jpg; Digi-Key Part Number: 490-1313-1-ND; Packaging: Cut Tape (CT); Series: GRM; Value: 10000pF; Voltage: 16V; Temperature Coefficient: X7R; Operating Temperature: -55°C ~ 125°C; Features: -; Applications: General Purpose; Package / Case: 0402 (1005 Metric); Case/Package: 0402
C31 C45 C61 C62 = GRM155R60G475ME47D: CAP CER 4.7UF 4V X5R 0402; Manufacturer: Murata Electronics North America; Tolerance: ±20%; PartNumber: GRM155R60G475ME47D; Datasheets: http://www.murata.com/~/media/webrenewal/support/library/catalog/products/capacitor/mlcc/c02e.pdf; Image: //media.digikey.com/Renders/Murata%20Renders/ZRB-SERIES-0402.jpg; Digi-Key Part Number: 490-11980-1-ND; Packaging: Cut Tape (CT); Series: GRM; Value: 4.7uF; Voltage: 4V; Temperature Coefficient: X5R; Operating Temperature: -55°C ~ 85°C; Features: -; Applications: General Purpose; Package / Case: 0402 (1005 Metric); Case/Package: 0402
C47 C50 C53 = GRM21BR71A106KE51L: as C83 on sheet compute module USB; PartNumber: GRM21BR71A106KE51L; Datasheets: http://www.murata.com/~/media/webrenewal/support/library/catalog/products/capacitor/mlcc/c02e.pdf; Image: //media.digikey.com/Renders/Murata%20Renders/0805%20(2012%20Metric)%20.85mm.jpg; Digi-Key Part Number: 490-3905-1-ND; Series: GRM; Part Status: Active; Value: 10uF; Voltage: 10V; Temperature Coefficient: X7R; Operating Temperature: -55°C ~ 125°C; Features: -; Applications: General Purpose; Mounting Type: Surface Mount, MLCC; Package / Case: 0805 (2012 Metric); Case/Package: 0805
C48 C51 C54 C57-C59 = GRM219R61A226MEA0D: as C86 on sheet compute module USB; PartNumber: GRM219R61A226MEA0D; Datasheets: http://www.murata.com/~/media/webrenewal/support/library/catalog/products/capacitor/mlcc/c02e.pdf; Image: //media.digikey.com/Renders/Murata%20Renders/0805%20(2012%20Metric)%20.85mm.jpg; Digi-Key Part Number: 490-9951-1-ND; Series: GRM; Part Status: Active; Value: 22uF; Voltage: 10V; Temperature Coefficient: X5R; Operating Temperature: -55°C ~ 85°C; Features: Derating Recommended; Applications: General Purpose; Mounting Type: Surface Mount, MLCC; Package / Case: 0805 (2012 Metric); Case/Package: 0805
C49 C52 C55 = GRM155R60J334KE01D: CAP CER 0.33UF 6.3V X5R 0402; Manufacturer: Murata Electronics North America; Tolerance: ±10%; PartNumber: GRM155R60J334KE01D; Datasheets: http://www.murata.com/~/media/webrenewal/support/library/catalog/products/capacitor/mlcc/c02e.pdf; Image: //media.digikey.com/Renders/Murata%20Renders/ZRB-SERIES-0402.jpg; Digi-Key Part Number: 490-3265-1-ND; Packaging: Cut Tape (CT); Series: GRM; Value: 0.33uF; Voltage: 6.3V; Temperature Coefficient: X5R; Operating Temperature: -55°C ~ 85°C; Features: -; Applications: General Purpose; Package / Case: 0402 (1005 Metric); Case/Package: 0402
J7 = 1757242: TERM BLOCK HDR 2POS 90DEG 5.08MM; Manufacturer: Phoenix Contact; PartNumber: 1757268; ComponentLink2Description: Datasheet; ComponentLink2URL: 1757268_06_en_00.pdf
L2-L4 = SWPA4030S1R5NT: 1.5uH ±20% 3.34A 26mΩ SMD,4.0x4.0x3.0mm Power Inductors RoHS; Manufacturer: Sunlord; PartNumber: SWPA4030S1R5NT; Datasheets: https://datasheet.lcsc.com/szlcsc/1810161020_Sunlord-SWPA4030S1R5NT_C42100.pdf; LCSC PartNumber: C42100; Inductance: 1.5uH; Tolerance: ±20%; DC Resistance: 26mΩ; Saturation current: 3.34A; Packaging: Cut Tape (CT); Package / Case: SMD,4.0x4.0x3.0mm; Case/Package: SMD,4.0x4.0x3.0mm
P5 = Header 4X2: Header, 4-Pin, Dual row; LatestRevisionDate: 17-Jul-2002; LatestRevisionNote: Re-released for DXP Platform.; Publisher: Altium Limited
P8 = Header 4: Header, 4-Pin; LatestRevisionDate: 17-Jul-2002; LatestRevisionNote: Re-released for DXP Platform.; Publisher: Altium Limited
P9 P10 = Header 2: Header, 2-Pin; LatestRevisionDate: 17-Jul-2002; LatestRevisionNote: Re-released for DXP Platform.; Publisher: Altium Limited
R7 = ERJ-2RKF1273X: RES SMD 127K OHM 1% 1/10W 0402; Manufacturer: Panasonic Electronic Components; Power (Watts): 0.1W, 1/10W; Temperature Coefficient: ±100ppm/°C; PartNumber: ERJ-2RKF1273X; Datasheets: http://industrial.panasonic.com/www-cgi/jvcr13pz.cgi?E+PZ+3+AOA0002+ERJ2RKF1273X+7+WW; Image: //media.digikey.com/Photos/Panasonic%20Photos/ERJ-PA2-Series.jpg; Digi-Key Part Number: P127KLCT-ND; Series: ERJ; Value: 127k; Tolerance: ±1%; Composition: Thick Film; Features: Automotive AEC-Q200; Operating Temperature: -55°C ~ 155°C; Package / Case: 0402 (1005 Metric); Case/Package: 0402; Size / Dimension: 0.039" L x 0.020" W (1.00mm x 0.50mm); Height - Seated (Max): 0.016" (0.40mm); Number of Terminations: 2
R8 R13 = ERJ-2RKF3003X: RES SMD 300K OHM 1% 1/10W 0402; Manufacturer: Panasonic Electronic Components; Power (Watts): 0.1W, 1/10W; Temperature Coefficient: ±100ppm/°C; PartNumber: ERJ-2RKF3003X; Datasheets: http://industrial.panasonic.com/www-cgi/jvcr13pz.cgi?E+PZ+3+AOA0002+ERJ2RKF3003X+7+WW; Image: //media.digikey.com/Photos/Panasonic%20Photos/ERJ-PA2-Series.jpg; Digi-Key Part Number: P300KLCT-ND; Series: ERJ; Value: 300k; Tolerance: ±1%; Composition: Thick Film; Features: Automotive AEC-Q200; Operating Temperature: -55°C ~ 155°C; Package / Case: 0402 (1005 Metric); Case/Package: 0402; Size / Dimension: 0.039" L x 0.020" W (1.00mm x 0.50mm); Height - Seated (Max): 0.016" (0.40mm); Number of Terminations: 2
R12 = ERJ-PA2F4703X: RES SMD 470K OHM 1% 1/5W 0402; Manufacturer: Panasonic Electronic Components; Power (Watts): 0.2W, 1/5W; Temperature Coefficient: ±100ppm/°C; PartNumber: ERJ-PA2F4703X; Datasheets: https://industrial.panasonic.com/cdbs/www-data/pdf/RDA0000/AOA0000C243.pdf; Image: //media.digikey.com/Photos/Panasonic%20Photos/ERJ-PA2-Series.jpg; Digi-Key Part Number: P17240CT-ND; Series: ERJ; Value: 470k; Tolerance: ±1%; Composition: Thick Film; Features: Automotive AEC-Q200, Pulse Withstanding; Operating Temperature: -55°C ~ 155°C; Package / Case: 0402 (1005 Metric); Case/Package: 0402; Size / Dimension: 0.039" L x 0.020" W (1.00mm x 0.50mm); Height - Seated (Max): 0.016" (0.40mm); Number of Terminations: 2
R17 = ERJ-2RKF5603X: RES SMD 560K OHM 1% 1/10W 0402; Manufacturer: Panasonic Electronic Components; Power (Watts): 0.1W, 1/10W; Temperature Coefficient: ±100ppm/°C; PartNumber: ERJ-2RKF5603X; Datasheets: http://industrial.panasonic.com/www-cgi/jvcr13pz.cgi?E+PZ+3+AOA0002+ERJ2RKF5603X+7+WW; Image: //media.digikey.com/Photos/Panasonic%20Photos/ERJ-PA2-Series.jpg; Digi-Key Part Number: P560KLCT-ND; Series: ERJ; Value: 560k; Tolerance: ±1%; Composition: Thick Film; Features: Automotive AEC-Q200; Operating Temperature: -55°C ~ 155°C; Package / Case: 0402 (1005 Metric); Case/Package: 0402; Size / Dimension: 0.039" L x 0.020" W (1.00mm x 0.50mm); Height - Seated (Max): 0.016" (0.40mm); Number of Terminations: 2
R18 = ERJ-PA2F1503X: RES SMD 150K OHM 1% 1/5W 0402; Manufacturer: Panasonic Electronic Components; Power (Watts): 0.2W, 1/5W; Temperature Coefficient: ±100ppm/°C; PartNumber: ERJ-PA2F1503X; Datasheets: https://industrial.panasonic.com/cdbs/www-data/pdf/RDA0000/AOA0000C243.pdf; Image: //media.digikey.com/Photos/Panasonic%20Photos/ERJ-PA2-Series.jpg; Digi-Key Part Number: P17237CT-ND; Series: ERJ; Value: 150k; Tolerance: ±1%; Composition: Thick Film; Features: Automotive AEC-Q200, Pulse Withstanding; Operating Temperature: -55°C ~ 155°C; Package / Case: 0402 (1005 Metric); Case/Package: 0402; Size / Dimension: 0.039" L x 0.020" W (1.00mm x 0.50mm); Height - Seated (Max): 0.016" (0.40mm); Number of Terminations: 2
R19 R20 R22 = ERJ-PA2F1003X: RES SMD 100K OHM 1% 1/5W 0402; Manufacturer: Panasonic Electronic Components; Power (Watts): 0.2W, 1/5W; Temperature Coefficient: ±100ppm/°C; PartNumber: ERJ-PA2F1003X; Datasheets: https://industrial.panasonic.com/cdbs/www-data/pdf/RDA0000/AOA0000C243.pdf; Image: //media.digikey.com/Photos/Panasonic%20Photos/ERJ-PA2-Series.jpg; Digi-Key Part Number: P17236CT-ND; Series: ERJ; Value: 100k; Tolerance: ±1%; Composition: Thick Film; Features: Automotive AEC-Q200, Pulse Withstanding; Operating Temperature: -55°C ~ 155°C; Package / Case: 0402 (1005 Metric); Case/Package: 0402; Size / Dimension: 0.039" L x 0.020" W (1.00mm x 0.50mm); Height - Seated (Max): 0.016" (0.40mm); Number of Terminations: 2
R21 R23-R27 = ERJ-2GE0R00X: RES SMD 0.0OHM JUMPER 1/10W 0402; Manufacturer: Panasonic Electronic Components; Power (Watts): 0.1W, 1/10W; PartNumber: ERJ-2GE0R00X; Datasheets: http://industrial.panasonic.com/www-cgi/jvcr13pz.cgi?E+PZ+3+AOA0001+ERJ2GE0R00X+7+WW; Image: //media.digikey.com/Photos/Panasonic%20Photos/ERJ-PA2-Series.jpg; Digi-Key Part Number: P0.0JCT-ND; Series: ERJ; Value: 0.0; Tolerance: Jumper; Composition: Thick Film; Features: Automotive AEC-Q200; Temperature Coefficient: -; Operating Temperature: -55°C ~ 155°C; Package / Case: 0402 (1005 Metric); Case/Package: 0402; Size / Dimension: 0.039" L x 0.020" W (1.00mm x 0.50mm); Height - Seated (Max): 0.016" (0.40mm); Number of Terminations: 2
U1 U5 U7 = TPS621361RGXR: IC REG BUCK ADJUSTABLE 4A 11VQFN; Manufacturer: Texas Instruments; PartNumber: TPS621361RGXR; Digikey PartNumber: 296-50117-2-ND
U12 U13 = MIC94325YMT-TR: 500mA LDO with  Ripple Blocker Technology; Manufacturer: Microchip Technology; PartNumber: MIC94325YMT-TR; Digikey PartNumber: 576-4164-2-ND

## Sheet FPGA sdram.SchDoc: FPGA SDRAM
size A4; Organization: Blinkinlabs, LLC; DocumentNumber: 13; SheetNumber: 14; SheetTotal: 14
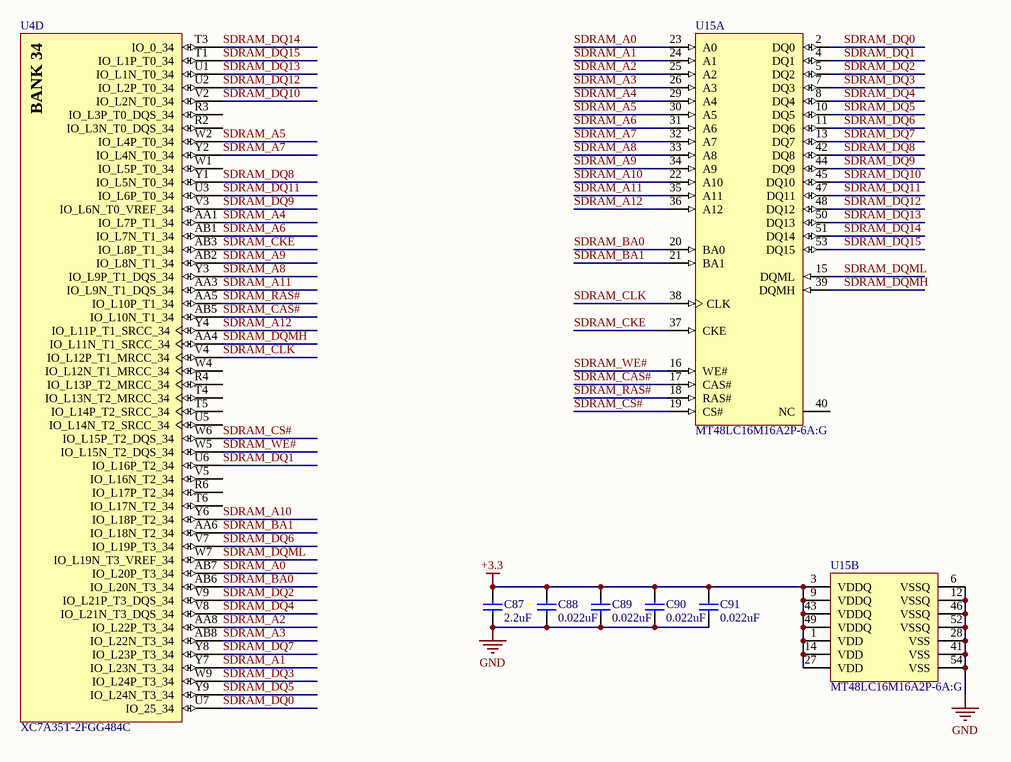
[diagram p13: FPGA sdram.SchDoc]

### Parts
C87  2.2uF  [CAPC1005X06L]
C88  0.022uF  [CAPC1005X06L]
C89  0.022uF  [CAPC1005X06L]
C90  0.022uF  [CAPC1005X06L]
C91  0.022uF  [CAPC1005X06L]
U4  XC7A35T-2FGG484C  [FGG484]  (part D of 12)
U15  MT48LC16M16A2P-6A:G  [MICT-TG-54_M]  (parts A,B of 2)

### Nets
+3.3: C87.1 C88.1 C89.1 C90.1 C91.1 U15.1(VDD) U15.3(VDDQ) U15.9(VDDQ) U15.14(VDD) U15.27(VDD) U15.43(VDDQ) U15.49(VDDQ)
GND: C87.2 C88.2 C89.2 C90.2 C91.2 U15.6(VSSQ) U15.12(VSSQ) U15.28(VSS) U15.41(VSS) U15.46(VSSQ) U15.52(VSSQ) U15.54(VSS)
SDRAM_A0: U4.AB7(IO_L20P_T3_34) U15.23(A0)
SDRAM_A1: U4.Y7(IO_L23N_T3_34) U15.24(A1)
SDRAM_A2: U4.AA8(IO_L22P_T3_34) U15.25(A2)
SDRAM_A3: U4.AB8(IO_L22N_T3_34) U15.26(A3)
SDRAM_A4: U4.AA1(IO_L7P_T1_34) U15.29(A4)
SDRAM_A5: U4.W2(IO_L4P_T0_34) U15.30(A5)
SDRAM_A6: U4.AB1(IO_L7N_T1_34) U15.31(A6)
SDRAM_A7: U4.Y2(IO_L4N_T0_34) U15.32(A7)
SDRAM_A8: U4.Y3(IO_L9P_T1_DQS_34) U15.33(A8)
SDRAM_A9: U4.AB2(IO_L8N_T1_34) U15.34(A9)
SDRAM_A10: U4.Y6(IO_L18P_T2_34) U15.22(A10)
SDRAM_A11: U4.AA3(IO_L9N_T1_DQS_34) U15.35(A11)
SDRAM_A12: U4.Y4(IO_L11P_T1_SRCC_34) U15.36(A12)
SDRAM_BA0: U4.AB6(IO_L20N_T3_34) U15.20(BA0)
SDRAM_BA1: U4.AA6(IO_L18N_T2_34) U15.21(BA1)
SDRAM_CAS#: U4.AB5(IO_L10N_T1_34) U15.17(CAS#)
SDRAM_CKE: U4.AB3(IO_L8P_T1_34) U15.37(CKE)
SDRAM_CLK: U4.V4(IO_L12P_T1_MRCC_34) U15.38(CLK)
SDRAM_CS#: U4.W6(IO_L15P_T2_DQS_34) U15.19(CS#)
SDRAM_DQ0: U4.U7(IO_25_34) U15.2(DQ0)
SDRAM_DQ1: U4.U6(IO_L16P_T2_34) U15.4(DQ1)
SDRAM_DQ2: U4.V9(IO_L21P_T3_DQS_34) U15.5(DQ2)
SDRAM_DQ3: U4.W9(IO_L24P_T3_34) U15.7(DQ3)
SDRAM_DQ4: U4.V8(IO_L21N_T3_DQS_34) U15.8(DQ4)
SDRAM_DQ5: U4.Y9(IO_L24N_T3_34) U15.10(DQ5)
SDRAM_DQ6: U4.V7(IO_L19P_T3_34) U15.11(DQ6)
SDRAM_DQ7: U4.Y8(IO_L23P_T3_34) U15.13(DQ7)
SDRAM_DQ8: U4.Y1(IO_L5N_T0_34) U15.42(DQ8)
SDRAM_DQ9: U4.V3(IO_L6N_T0_VREF_34) U15.44(DQ9)
SDRAM_DQ10: U4.V2(IO_L2N_T0_34) U15.45(DQ10)
SDRAM_DQ11: U4.U3(IO_L6P_T0_34) U15.47(DQ11)
SDRAM_DQ12: U4.U2(IO_L2P_T0_34) U15.48(DQ12)
SDRAM_DQ13: U4.U1(IO_L1N_T0_34) U15.50(DQ13)
SDRAM_DQ14: U4.T3(IO_0_34) U15.51(DQ14)
SDRAM_DQ15: U4.T1(IO_L1P_T0_34) U15.53(DQ15)
SDRAM_DQMH: U4.AA4(IO_L11N_T1_SRCC_34) U15.39(DQMH)
SDRAM_DQML: U4.W7(IO_L19N_T3_VREF_34) U15.15(DQML)
SDRAM_RAS#: U4.AA5(IO_L10P_T1_34) U15.18(RAS#)
SDRAM_WE#: U4.W5(IO_L15N_T2_DQS_34) U15.16(WE#)

Not connected (* = marked no-connect by the designer): U4 R2(IO_L3N_T0_DQS_34) R3(IO_L3P_T0_DQS_34) R4(IO_L13P_T2_MRCC_34) R6(IO_L17P_T2_34) T4(IO_L13N_T2_MRCC_34) T5(IO_L14P_T2_SRCC_34) T6(IO_L17N_T2_34) U5(IO_L14N_T2_SRCC_34) V5(IO_L16N_T2_34) W1(IO_L5P_T0_34) W4(IO_L12N_T1_MRCC_34); U15 40(NC)

### Notes on the sheet
- Title:
- Project:
- Revision:
- Date:
- Time:
- Sheet
- of
- (in symbol CMP-0383-00019-1, part D) BANK 34

### Library data of the parts
C87 = GRM155R61A225KE95D: CAP CER 2.2UF 10V X5R 0402; Manufacturer: Murata Electronics North America; Tolerance: ±10%; PartNumber: GRM155R61A225KE95D; Datasheets: http://www.murata.com/~/media/webrenewal/support/library/catalog/products/capacitor/mlcc/c02e.pdf; Image: //media.digikey.com/Renders/Murata%20Renders/ZRB-SERIES-0402.jpg; Digi-Key Part Number: 490-10451-1-ND; Packaging: Cut Tape (CT); Series: GRM; Value: 2.2uF; Voltage: 10V; Temperature Coefficient: X5R; Operating Temperature: -55°C ~ 85°C; Features: Derating Recommended; Applications: General Purpose; Package / Case: 0402 (1005 Metric); Case/Package: 0402
C88-C91 = GRM155R61A223KA01D: CAP CER 0.022UF 10V X5R 0402; Manufacturer: Murata Electronics North America; Tolerance: ±10%; PartNumber: GRM155R61A223KA01D; Datasheets: http://www.murata.com/~/media/webrenewal/support/library/catalog/products/capacitor/mlcc/c02e.pdf; Image: //media.digikey.com/Renders/Murata%20Renders/ZRB-SERIES-0402.jpg; Digi-Key Part Number: 490-6302-1-ND; Packaging: Cut Tape (CT); Series: GRM; Value: 0.022uF; Voltage: 10V; Temperature Coefficient: X5R; Operating Temperature: -55°C ~ 85°C; Features: -; Applications: General Purpose; Package / Case: 0402 (1005 Metric); Case/Package: 0402
U4 = CMP-0383-00019-1: as U4 on sheet FPGA GPIO; ComponentLink3URL: http://www.xilinx.com/support/documentation/user_guides/ug475_7Series_Pkg_Pinout.pdf; PackageVersion: Rev. 1.11; ComponentLink2Description: Datasheet; ComponentLink3Description: Pinout; PartNumber: XC7A35T-2FGG484C; DatasheetVersion: Rev. 1.15; Operating Temperature Range: Commercial; PackageDescription: 484-Ball Wire-Bond Fine-Pitch BGA, Body 23 x 23 mm, Pitch 1 mm; ComponentLink4Description: Package Specification; Maximum Distributed RAM: 400 Kb; Mounting Technology: Surface Mount; ComponentLink2URL: http://www.xilinx.com/support/documentation/data_sheets/ds180_7Series_Overview.pdf; ComponentLink1Description: Manufacturer URL; ComponentLink4URL: http://www.xilinx.com/support/documentation/user_guides/ug475_7Series_Pkg_Pinout.pdf; PackageReference: FGG484; ComponentLink1URL: http://www.xilinx.com/
U15 = CMP-2000-05232-1: 256 Mb PC133 SDR SDRAM, 16 Mb x 16, 3 to 3.6 V, 0 to 70 degC, 54-Pin TSOP (TG), Pb-Free; Manufacturer: Micron; Maximum Random Access Time: 6ns; Organisation: 16Mx16bit; Package Version: Rev.W, 05/2012; Minimum Operating Supply Voltage: 3V; Number of Bits per Word: 16bit; Address Bus Width: 15bit; Memory Size: 256MB; Maximum Operating Supply Voltage: 3.6V; Number of Words: 16M; Maximum Operating Temperature: +70degC; Manufacturer URL: https://www.micron.com/; Package URL: https://www.micron.com/~/media/documents/products/data-sheet/dram/256mb_sdr.pdf; Package Type: TSOP; Mounting Type: SurfaceMount; Package Reference: TG-54; Dimensions: 22.22x10.16x1.2mm; Pin Count: 54; Datasheet URL: https://www.micron.com/~/media/documents/products/data-sheet/dram/256mb_sdr.pdf; Height: 1.2mm; Length: 22.22mm; Data Bus Width: 16bit; Datasheet Version: Rev. W, 05/2015; Minimum Operating Temperature: 0degC; Package Description: 54-Pin Thin Small Outline Package, Body 10.2 x 22.3 mm, Pitch 0.8 mm; Width: 10.16mm

## Nets that join several sheets
+1: FPGA power (24 pins), FPGA power supply (6 pins)
+1.8: FPGA power (14 pins), FPGA power supply (12 pins)
+3.3: FPGA power (73 pins), FPGA programming (13 pins), FPGA GPIO (17 pins), FPGA power supply (6 pins), FPGA sdram (12 pins)
+5: compute module power (6 pins), compute module HDMI out (J2.18), compute module USB (6 pins), FPGA power supply (11 pins)
GND: FPGA PCIe (12 pins), FPGA power (138 pins), FPGA programming (16 pins), compute module (J6.1 P3.21 P3.22 U3.3), compute module power (52 pins), compute module Ethernet (7 pins), compute module HDMI out (13 pins), compute module microsd (8 pins), compute module USB (18 pins), FPGA GPIO (22 pins), FPGA power supply (42 pins), FPGA sdram (12 pins)
MTGAVCC: FPGA PCIe (8 pins), FPGA power supply (5 pins)
MTGAVTT: FPGA PCIe (10 pins), FPGA power supply (5 pins)
PI_+3.3: compute module (6 pins), compute module power (CM4.84 CM4.86), compute module Ethernet (J5.L1 J5.L3), compute module HDMI out (J8.22 R34.2 R35.2), compute module microsd (C56.2 U6.1), compute module USB (C60.2 P1.1 U2.1)
FPGA_PROGRAM_B: FPGA programming (P11.10 R14.1 U4.N12), compute module (CM4.37)
FPGA_PUDC_B: FPGA programming (R33.2), FPGA GPIO (U4.U22)
FPGA_SPI_D02: FPGA programming (P7.4 R28.1 U14.3), FPGA GPIO (U4.P21)
FPGA_SPI_D03: FPGA programming (P7.2 R30.1 U14.7), FPGA GPIO (U4.R21)
FPGA_SPI_DO0: FPGA programming (P7.6 U14.5), FPGA GPIO (U4.P22)
FPGA_SPI_DO1: FPGA programming (P7.3 U14.2), FPGA GPIO (U4.R22)
FPGA_SPI_FCS_B: FPGA programming (P7.7 R29.1 U14.1), FPGA GPIO (U4.T19)
FPGA_TCK: FPGA programming (P11.4 U4.V12), compute module (CM4.38)
FPGA_TDI: FPGA programming (P11.8 U4.R13), compute module (CM4.44)
FPGA_TDO: FPGA programming (P11.6 U4.U13), compute module (CM4.40)
FPGA_TMS: FPGA programming (P11.2 U4.T13), compute module (CM4.41)
PCIe_CLK_N: FPGA PCIe (U4.E6), compute module (CM4.112)
PCIe_CLK_P: FPGA PCIe (U4.F6), compute module (CM4.110)
PCIe_nREQ: compute module (CM4.102), FPGA GPIO (U4.D2)
PCIe_nRST: compute module (CM4.109), FPGA GPIO (U4.D1)
PCIe_RX_N: FPGA PCIe (C3.2), compute module (CM4.118)
PCIe_RX_P: FPGA PCIe (C2.2), compute module (CM4.116)
PCIe_TX_N: FPGA PCIe (U4.A8), compute module (CM4.124)
PCIe_TX_P: FPGA PCIe (U4.B8), compute module (CM4.122)